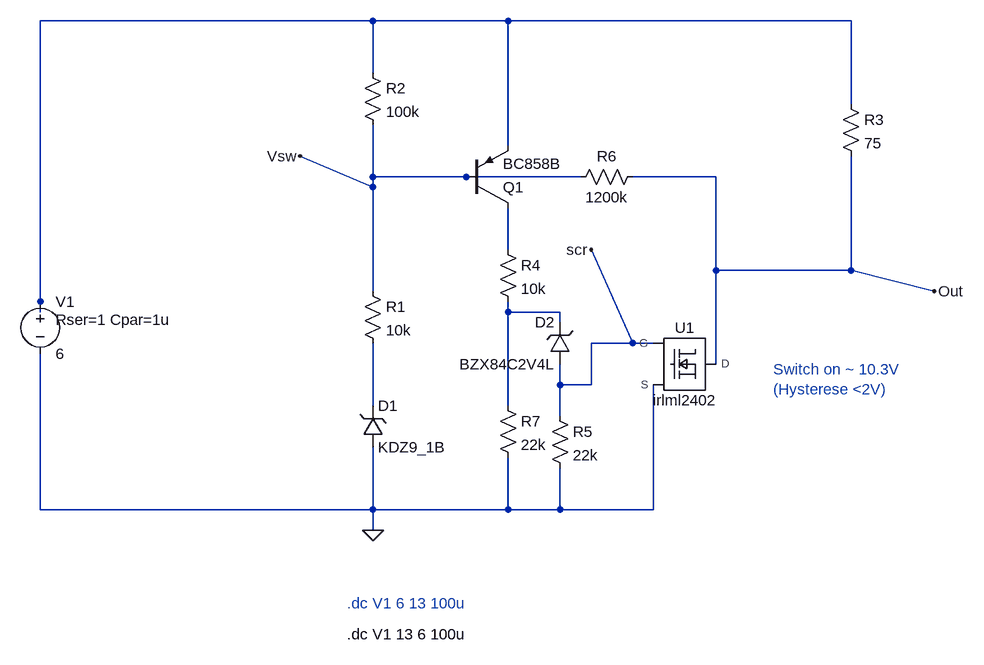
[diagram p0: schematic V0_SW01n.asc]
V0_SW01n.asc, the LTspice schematic file:
Version 4
SHEET 1 1000 680
WIRE 96 -384 -416 -384
WIRE 304 -384 96 -384
WIRE 832 -384 304 -384
WIRE 96 -304 96 -384
WIRE 832 -256 832 -384
WIRE 304 -192 304 -384
WIRE 96 -144 96 -224
WIRE 240 -144 96 -144
WIRE 416 -144 240 -144
WIRE 624 -144 496 -144
WIRE 96 -128 -16 -176
WIRE 96 -128 96 -144
WIRE 304 -32 304 -96
WIRE 624 0 624 -144
WIRE 832 0 832 -176
WIRE 832 0 624 0
WIRE 96 32 96 -128
WIRE 960 32 832 0
WIRE -416 48 -416 -384
WIRE -416 64 -416 48
WIRE 304 64 304 48
WIRE 384 64 304 64
WIRE 384 80 384 64
WIRE 496 112 432 -32
WIRE 496 112 432 112
WIRE 528 112 496 112
WIRE 624 144 624 0
WIRE 384 176 384 144
WIRE 432 176 432 112
WIRE 432 176 384 176
WIRE 96 208 96 112
WIRE 304 208 304 64
WIRE 384 224 384 176
WIRE -416 368 -416 128
WIRE 96 368 96 272
WIRE 96 368 -416 368
WIRE 304 368 304 288
WIRE 304 368 96 368
WIRE 384 368 384 304
WIRE 384 368 304 368
WIRE 528 368 528 176
WIRE 528 368 384 368
WIRE 96 400 96 368
FLAG 96 400 0
FLAG 432 -32 scr
FLAG 960 32 Out
FLAG -16 -176 Vsw
SYMBOL res 80 16 R0
SYMATTR InstName R1
SYMATTR Value 10k
SYMBOL res 80 -320 R0
SYMATTR InstName R2
SYMATTR Value 100k
SYMBOL res 288 -48 R0
SYMATTR InstName R4
SYMATTR Value 10k
SYMBOL res 368 208 R0
SYMATTR InstName R5
SYMATTR Value 22k
SYMBOL zener 80 272 M180
WINDOW 0 24 64 Left 2
WINDOW 3 24 0 Left 2
SYMATTR InstName D1
SYMATTR Value KDZ9_1B
SYMBOL pnp 240 -96 M180
SYMATTR InstName Q1
SYMATTR Value BC858B
SYMBOL res 816 -272 R0
SYMATTR InstName R3
SYMATTR Value 75
SYMBOL voltage -416 32 R0
WINDOW 123 0 0 Left 0
WINDOW 39 24 44 Left 2
SYMATTR SpiceLine Rser=1 Cpar=1u
SYMATTR InstName V1
SYMATTR Value 6
SYMBOL res 512 -160 R90
WINDOW 0 0 56 VBottom 2
WINDOW 3 32 56 VTop 2
SYMATTR InstName R6
SYMATTR Value 1200k
SYMBOL zener 400 144 R180
WINDOW 0 24 64 Left 2
WINDOW 3 24 0 Left 2
SYMATTR InstName D2
SYMATTR Value BZX84C2V4L
SYMATTR Description Diode
SYMATTR Type diode
SYMBOL res 288 192 R0
SYMATTR InstName R7
SYMATTR Value 22k
SYMBOL smt_n-mos 576 144 R0
SYMATTR InstName U1
TEXT 56 512 Left 2 ;.dc V1 6 13 100u
TEXT 712 152 Left 2 ;Switch on ~ 10.3V\n(Hysterese <2V)
TEXT 56 560 Left 2 !.dc V1 13 6 100u

The netlist it stands for:
* V0_SW01n.asc
R1 Vsw N004 10k
R2 N001 Vsw 100k
R4 N002 N003 10k
R5 scr 0 22k
D1 0 N004 KDZ9_1B
Q1 N002 Vsw N001 0 BC858B
R3 N001 Out 75
V1 N001 0 6 Rser=1 Cpar=1u
R6 Out Vsw 1200k
D2 scr N003 BZX84C2V4L
R7 N003 0 22k
XU1 Out scr 0 irlml2402  ; pins D G S
.model D D
.lib standard.dio
.model NPN NPN
.model PNP PNP
.lib standard.bjt
* .dc V1 6 13 100u
* Switch on ~ 10.3V
* (Hysterese <2V)
.dc V1 13 6 100u
.lib ..\lib\irlml2402.lib
.backanno
.end